# EAGLE design v002 (EAGLE 6.4)
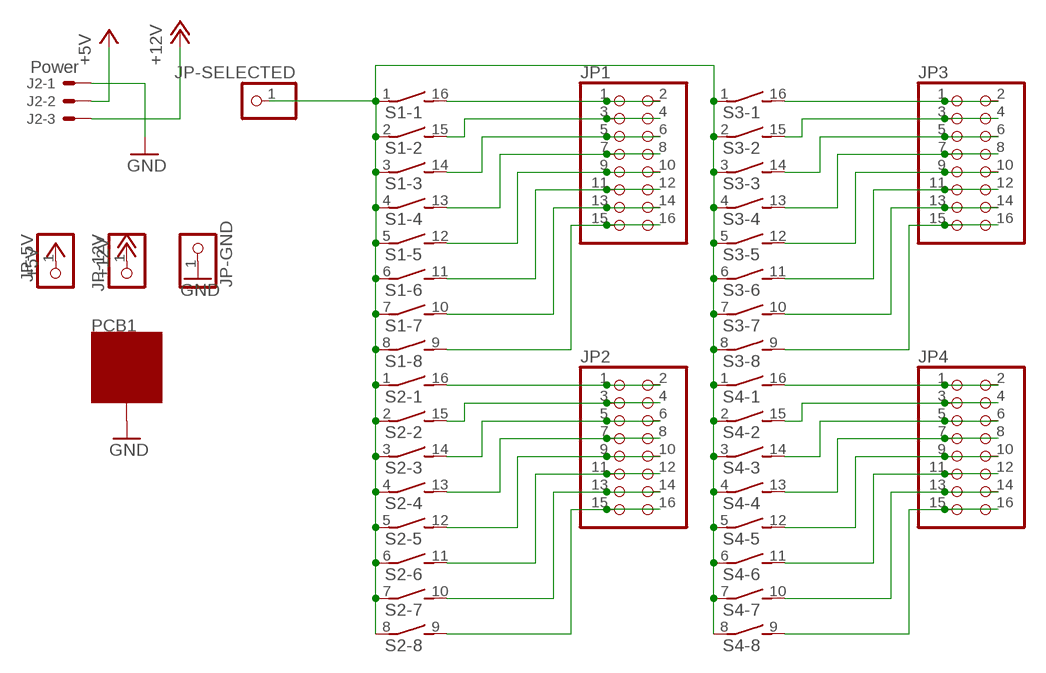
[diagram p0: schematic, sheet 1]

## Parts
J2  Power  22-27-2031-03  [6410-03]
JP1  PINHD-2X8  [2X08]
JP2  PINHD-2X8  [2X08]
JP3  PINHD-2X8  [2X08]
JP4  PINHD-2X8  [2X08]
JP-5V  PINHD-1X1  [1X01]
JP-12V  PINHD-1X1  [1X01]
JP-GND  PINHD-1X1  [1X01]
JP-SELECTED  PINHD-1X1  [1X01]
PCB1  ZZZ_MODULE05X05  [ZZZ_MODULE_05X05]
S1  DIP08S  [DIP08S]
S2  DIP08S  [DIP08S]
S3  DIP08S  [DIP08S]
S4  DIP08S  [DIP08S]

## Nets
+5V: J2.2 JP-5V.1
+12V: J2.3 JP-12V.1
GND: J2.1 JP-GND.1 PCB1.GND@1(GND) PCB1.GND@2(GND) PCB1.GND@3(GND) PCB1.GND@4(GND) PCB1.GND@5(GND) PCB1.GND@6(GND) PCB1.GND@7(GND) PCB1.GND@8(GND)
N$1: JP3.1 JP3.2 S3.16
N$2: JP3.3 JP3.4 S3.15
N$4: JP1.1 JP1.2 S1.16
N$5: JP1.3 JP1.4 S1.15
N$6: JP1.5 JP1.6 S1.14
N$7: JP1.7 JP1.8 S1.13
N$8: JP1.9 JP1.10 S1.12
N$9: JP1.11 JP1.12 S1.11
N$10: JP1.13 JP1.14 S1.10
N$11: JP1.15 JP1.16 S1.9
N$12: JP2.1 JP2.2 S2.16
N$13: JP2.3 JP2.4 S2.15
N$14: JP2.5 JP2.6 S2.14
N$15: JP2.7 JP2.8 S2.13
N$16: JP2.9 JP2.10 S2.12
N$17: JP2.11 JP2.12 S2.11
N$18: JP2.13 JP2.14 S2.10
N$19: JP2.15 JP2.16 S2.9
N$20: JP3.5 JP3.6 S3.14
N$21: JP3.7 JP3.8 S3.13
N$22: JP3.9 JP3.10 S3.12
N$23: JP3.11 JP3.12 S3.11
N$24: JP3.13 JP3.14 S3.10
N$25: JP3.15 JP3.16 S3.9
N$26: JP4.1 JP4.2 S4.16
N$27: JP4.3 JP4.4 S4.15
N$28: JP4.5 JP4.6 S4.14
N$29: JP4.7 JP4.8 S4.13
N$30: JP4.9 JP4.10 S4.12
N$31: JP4.11 JP4.12 S4.11
N$32: JP4.13 JP4.14 S4.10
N$33: JP4.15 JP4.16 S4.9
N$34: JP-SELECTED.1 S1.1 S1.2 S1.3 S1.4 S1.5 S1.6 S1.7 S1.8 S2.1 S2.2 S2.3 S2.4 S2.5 S2.6 S2.7 S2.8 S3.1 S3.2 S3.3 S3.4 S3.5 S3.6 S3.7 S3.8 S4.1 S4.2 S4.3 S4.4 S4.5 S4.6 S4.7 S4.8

## Library data of the parts
J2 = con-molex:22-?-03: CONNECTOR wire to board 2.54 mm (.1 inch) pitch header; OC_FARNELL: unknown; OC_NEWARK: unknown
JP1-JP4 = pinhead:PINHD-2X8: PIN HEADER
JP-5V JP-12V JP-GND JP-SELECTED = pinhead:PINHD-1X1: PIN HEADER
PCB1 = GNLib:ZZZ_MODULE
S1-S4 = switch-dil:DIP08S: DIL/CODE SWITCH; OC_FARNELL: unknown; OC_NEWARK: unknown

## Board
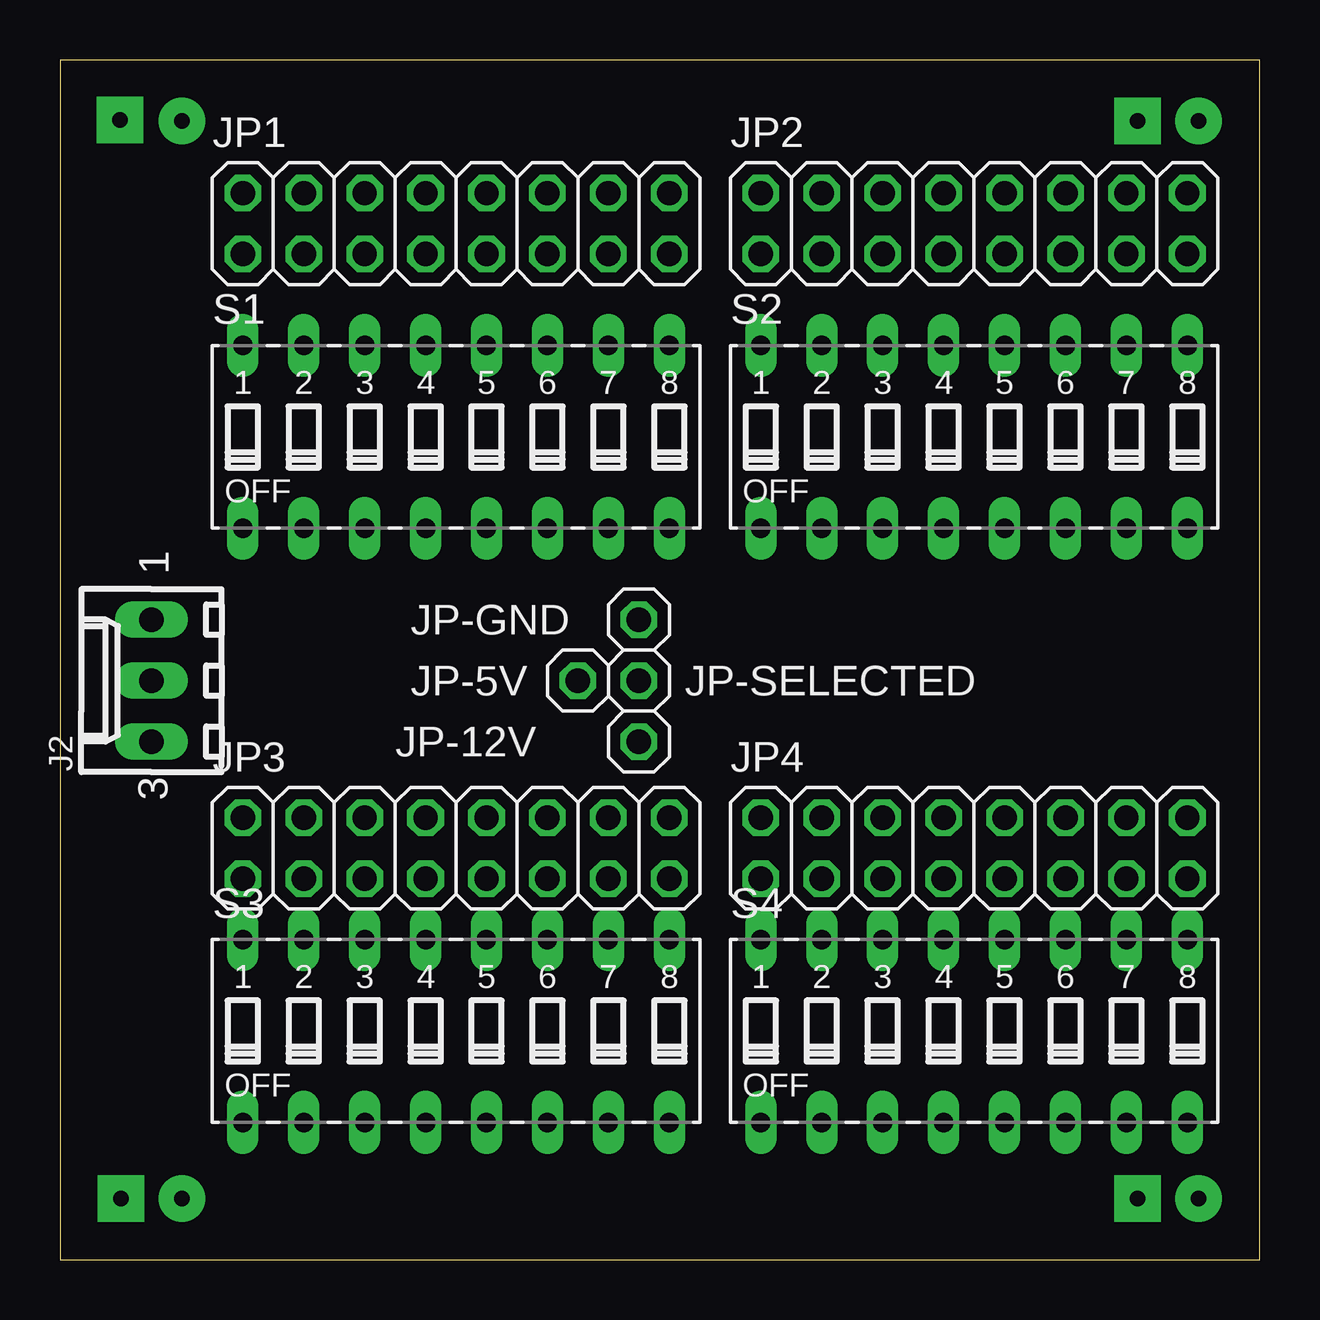
[diagram p1: board, top side]
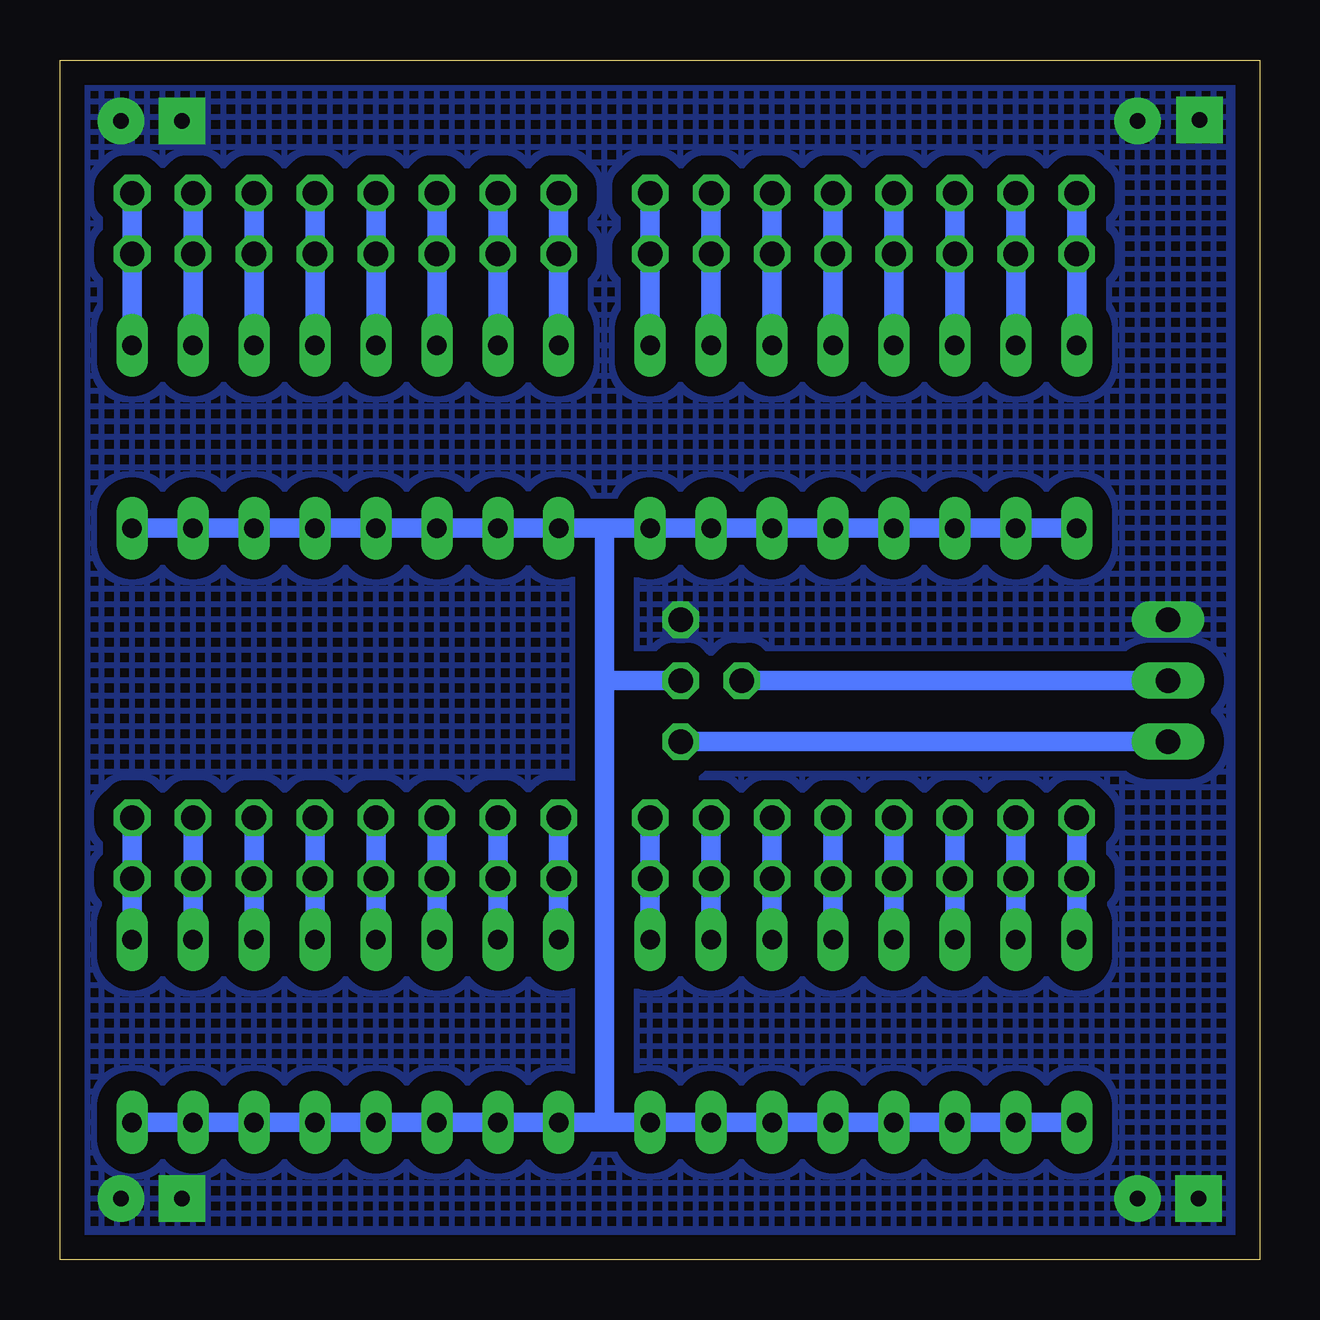
[diagram p2: board, bottom side, seen from below]

Size 50 x 50 mm. Coordinates in mm from the lower left corner, seen from the top.
Outline: 0,0 50,0 50,50 0,50 0,0
Copper layers (1*16): Top 0.035mm / dielectric 1.5mm / Bottom 0.035mm
Design rules "default": minimum track width 10mil, minimum drill 24mil, track to track 8mil, track to pad 8mil, pad to pad 8mil, via to via 8mil, smd to smd 8mil, copper to edge 40mil, drill to drill 8mil, minimum pad ring 10mil, minimum via ring 8mil, stop-mask expansion 4mil, vias tented up to drill 0mil, thermal gap 10mil

### Footprints (pad centres in the part's own frame; a part is rotated, then mirrored left to right if it is on the bottom)
6410-03 = drill 1.016 long: 1 2.54,0; 2 0,0; 3 -2.54,0
2X08 = drill 1.016 octagon: 1 -8.89,-1.27; 2 -8.89,1.27; 3 -6.35,-1.27; 4 -6.35,1.27; 5 -3.81,-1.27; 6 -3.81,1.27; 7 -1.27,-1.27; 8 -1.27,1.27; 9 1.27,-1.27; 10 1.27,1.27; 11 3.81,-1.27; 12 3.81,1.27; 13 6.35,-1.27; 14 6.35,1.27; 15 8.89,-1.27; 16 8.89,1.27
1X01 = drill 1.016 octagon: 1 0,0
ZZZ_MODULE_05X05 = drill 0.64 pad 1.93 square: GND@1 2.5,47.5; GND@2 44.92,47.46; GND@7 2.54,2.54; GND@8 44.92,2.54 | drill 0.64 pad 1.93: GND@3 47.46,47.46; GND@4 5.08,47.46; GND@5 47.46,2.54; GND@6 5.08,2.54
DIP08S = drill 0.813 long: 1 -8.89,-3.81; 2 -6.35,-3.81; 3 -3.81,-3.81; 4 -1.27,-3.81; 5 1.27,-3.81; 6 3.81,-3.81; 7 6.35,-3.81; 8 8.89,-3.81; 9 8.89,3.81; 10 6.35,3.81; 11 3.81,3.81; 12 1.27,3.81; 13 -1.27,3.81; 14 -3.81,3.81; 15 -6.35,3.81; 16 -8.89,3.81

### Placement (x,y rotation side)
J2  3.81,24.13 90 top
JP1  16.51,43.18 0 top
JP2  38.1,43.18 0 top
JP3  16.51,17.14 0 top
JP4  38.1,17.14 0 top
JP-5V  21.59,24.13 0 top
JP-12V  24.13,21.59 0 top
JP-GND  24.13,26.67 0 top
JP-SELECTED  24.13,24.13 0 top
PCB1  0,0 0 top
S1  16.51,34.29 0 top
S2  38.1,34.29 0 top
S3  16.51,9.53 0 top
S4  38.1,9.53 0 top

### Tracks (layer width: path | path; a pad name or v marks a point on that pad's centre or on a via)
+5V
  Bottom 0.813: J2.2 JP-5V.1
+12V
  Bottom 0.813: J2.3 JP-12V.1
GND
  pour Bottom (isolate 0.813, no thermals, hatched): 0,0 50,0 50,50 0,50
N$1
  Bottom 0.813: JP3.2 JP3.1 S3.16
N$2
  Bottom 0.813: S3.15 JP3.3 JP3.4
N$4
  Bottom 0.813: S1.16 JP1.1 JP1.2
N$5
  Bottom 0.813: JP1.4 JP1.3 S1.15
N$6
  Bottom 0.813: S1.14 JP1.5 JP1.6
N$7
  Bottom 0.813: JP1.8 JP1.7 S1.13
N$8
  Bottom 0.813: S1.12 JP1.9 JP1.10
N$9
  Bottom 0.813: JP1.12 JP1.11 S1.11
N$10
  Bottom 0.813: S1.10 JP1.13 JP1.14
N$11
  Bottom 0.813: JP1.16 JP1.15 S1.9
N$12
  Bottom 0.813: S2.16 JP2.1 JP2.2
N$13
  Bottom 0.813: JP2.4 JP2.3 S2.15
N$14
  Bottom 0.813: S2.14 JP2.5 JP2.6
N$15
  Bottom 0.813: JP2.8 JP2.7 S2.13
N$16
  Bottom 0.813: S2.12 JP2.9 JP2.10
N$17
  Bottom 0.813: JP2.12 JP2.11 S2.11
N$18
  Bottom 0.813: S2.10 JP2.13 JP2.14
N$19
  Bottom 0.813: JP2.16 JP2.15 S2.9
N$20
  Bottom 0.813: JP3.6 JP3.5 S3.14
N$21
  Bottom 0.813: S3.13 JP3.7 JP3.8
N$22
  Bottom 0.813: JP3.10 JP3.9 S3.12
N$23
  Bottom 0.813: S3.11 JP3.11 JP3.12
N$24
  Bottom 0.813: JP3.14 JP3.13 S3.10
N$25
  Bottom 0.813: S3.9 JP3.15 JP3.16
N$26
  Bottom 0.813: JP4.2 JP4.1 S4.16
N$27
  Bottom 0.813: S4.15 JP4.3 JP4.4
N$28
  Bottom 0.813: JP4.6 JP4.5 S4.14
N$29
  Bottom 0.813: S4.13 JP4.7 JP4.8
N$30
  Bottom 0.813: JP4.10 JP4.9 S4.12
N$31
  Bottom 0.813: S4.11 JP4.11 JP4.12
N$32
  Bottom 0.813: JP4.14 JP4.13 S4.10
N$33
  Bottom 0.813: S4.9 JP4.15 JP4.16
N$34
  Bottom 0.813: S1.1 S1.2 S1.3 S1.4 S1.5 S1.6 S1.7 S1.8 27.3,30.48 | 27.3,30.48 S2.1 S2.2 S2.3 S2.4 S2.5 S2.6 S2.7 S2.8 | 27.3,5.71 S3.8 S3.7 S3.6 S3.5 S3.4 S3.3 S3.2 S3.1 | 27.3,5.71 27.3,24.13 | 27.3,24.13 27.3,30.48 | S4.8 S4.7 S4.6 S4.5 S4.4 S4.3 S4.2 S4.1 27.3,5.71 | JP-SELECTED.1 27.3,24.13